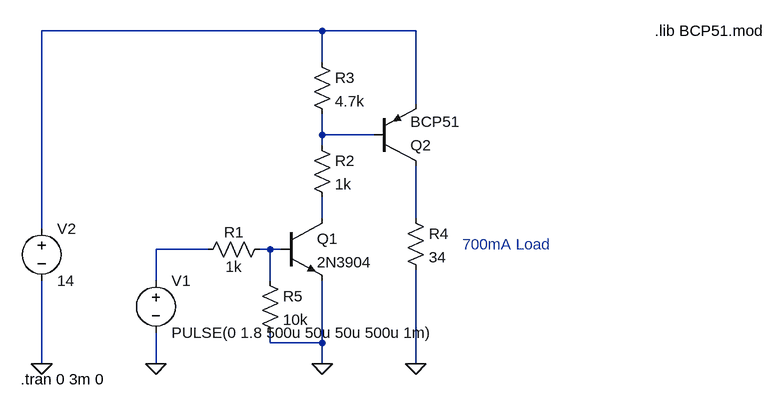
[diagram p0: schematic switch.asc]
switch.asc, the LTspice schematic file:
Version 4
SHEET 1 1336 680
WIRE 560 -416 128 -416
WIRE 704 -416 560 -416
WIRE 560 -368 560 -416
WIRE 704 -304 704 -416
WIRE 560 -256 560 -288
WIRE 640 -256 560 -256
WIRE 560 -240 560 -256
WIRE 560 -128 560 -160
WIRE 704 -128 704 -208
WIRE 128 -112 128 -416
WIRE 384 -80 304 -80
WIRE 480 -80 464 -80
WIRE 496 -80 480 -80
WIRE 304 -32 304 -80
WIRE 480 -32 480 -80
WIRE 480 64 480 48
WIRE 560 64 560 -32
WIRE 560 64 480 64
WIRE 128 96 128 -32
WIRE 304 96 304 48
WIRE 560 96 560 64
WIRE 704 96 704 -48
FLAG 128 96 0
FLAG 304 96 0
FLAG 560 96 0
FLAG 704 96 0
SYMBOL voltage 304 -48 R0
WINDOW 123 0 0 Left 0
WINDOW 39 0 0 Left 0
SYMATTR InstName V1
SYMATTR Value PULSE(0 1.8 500u 50u 50u 500u 1m)
SYMBOL res 480 -96 R90
WINDOW 0 5 56 VBottom 2
WINDOW 3 27 56 VTop 2
SYMATTR InstName R1
SYMATTR Value 1k
SYMBOL res 544 -256 R0
SYMATTR InstName R2
SYMATTR Value 1k
SYMBOL res 544 -384 R0
SYMATTR InstName R3
SYMATTR Value 4.7k
SYMBOL npn 496 -128 R0
SYMATTR InstName Q1
SYMATTR Value 2N3904
SYMBOL pnp 640 -208 M180
SYMATTR InstName Q2
SYMATTR Value BCP51
SYMATTR Prefix X
SYMBOL voltage 128 -128 R0
WINDOW 123 0 0 Left 0
WINDOW 39 0 0 Left 0
SYMATTR InstName V2
SYMATTR Value 14
SYMBOL res 688 -144 R0
SYMATTR InstName R4
SYMATTR Value 34
SYMBOL res 464 -48 R0
SYMATTR InstName R5
SYMATTR Value 10k
TEXT 776 -88 Left 2 ;700mA Load
TEXT 96 120 Left 2 !.tran 0 3m 0
TEXT 1072 -416 Left 2 !.lib BCP51.mod

The netlist it stands for:
* switch.asc
V1 N005 0 PULSE(0 1.8 500u 50u 50u 500u 1m)
R1 N006 N005 1k
R2 N002 N003 1k
R3 N001 N002 4.7k
Q1 N003 N006 0 0 2N3904
XQ2 N004 N002 N001 BCP51  ; pins C B E
V2 N001 0 14
R4 N004 0 34
R5 N006 0 10k
.model NPN NPN
.model PNP PNP
.lib standard.bjt
* 700mA Load
.tran 0 3m 0
.lib BCP51.mod
.backanno
.end